# Altium project VOLTAGE_PEAK_V3.PrjPCB
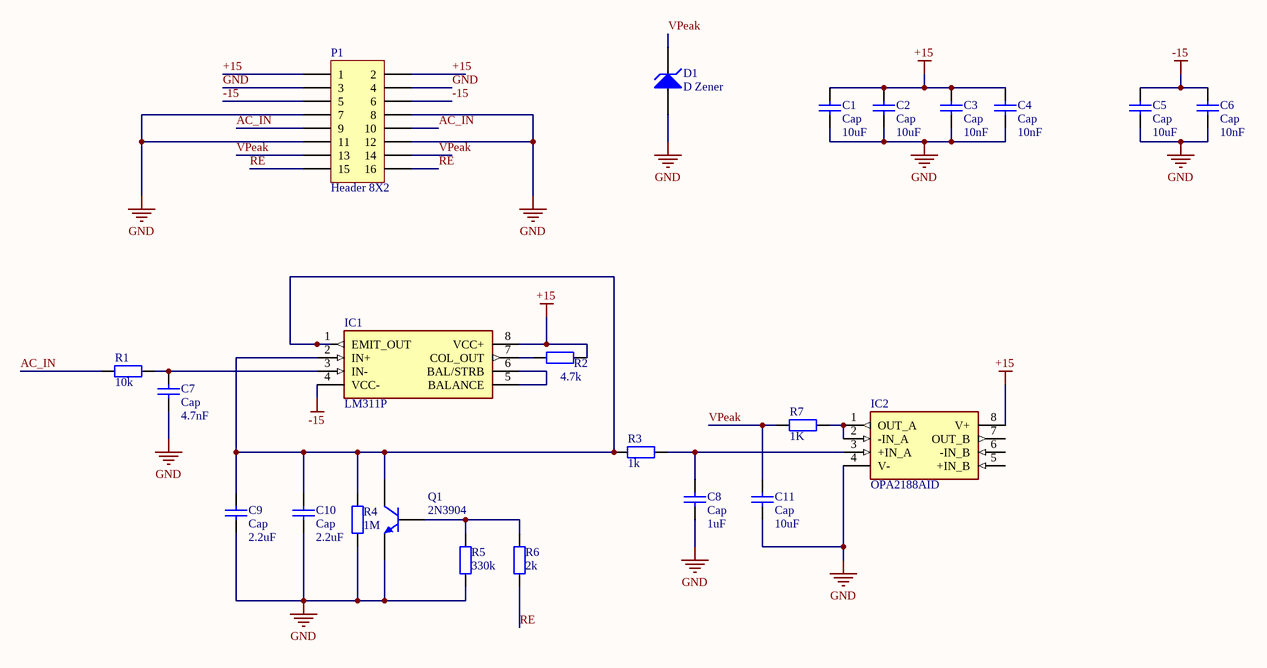
[diagram p0: VOLTAGE_PEAK_V3.SchDoc]
1 sheet, 23 parts. Net scope: global (net labels, ports and power ports of the same name join across sheets).
Board file: VOLTAGE_PEAK_V3.PcbDoc

## Sheet VOLTAGE_PEAK_V3.SchDoc
size A4

### Parts
C1  Cap  value 10uF  [C0805]
C2  Cap  value 10uF  [C0805]
C3  Cap  value 10nF  [1608[0603]]
C4  Cap  value 10nF  [1608[0603]]
C5  Cap  value 10uF  [C0805]
C6  Cap  value 10nF  [1608[0603]]
C7  Cap  value 4.7nF  [1608[0603]]
C8  Cap  value 1uF  [C0805]
C9  Cap  value 2.2uF  [C0805]
C10  Cap  value 2.2uF  [C0805]
C11  Cap  value 10uF  [C0805]
D1  D Zener  [C1206]
IC1  LM311P  [DIP794W53P254L959H508Q8N]
IC2  OPA2188AID  [SOIC127P600X175-8N]
P1  Header 8X2  [HDR2X8]
Q1  2N3904  [TO-92A]
R1  value 10k  [1608[0603]]  (hidden comment: Res2)
R2  value 4.7k  [1608[0603]]  (hidden comment: Res2)
R3  value 1k  [1608[0603]]  (hidden comment: Res2)
R4  value 1M  [1608[0603]]  (hidden comment: Res2)
R5  value 330k  [1608[0603]]  (hidden comment: Res2)
R6  value 2k  [1608[0603]]  (hidden comment: Res2)
R7  value 1K  [1608[0603]]  (hidden comment: Res2)

### Nets
+15: C1.2 C2.2 C3.1 C4.1 IC1.8(VCC+) IC2.8(V+) P1.1 P1.2 R2.2
-15: C5.2 C6.1 IC1.4(VCC-) P1.5 P1.6
GND: C1.1 C2.1 C3.2 C4.2 C5.1 C6.2 C7.2 C8.2 C9.2 C10.2 C11.2 D1.1(A) IC2.4(V-) P1.3 P1.4 P1.7 P1.8 P1.11 P1.12 Q1.1(E) R4.1 R5.1
AC_IN: P1.9 P1.10 R1.1
RE: P1.15 P1.16 R6.1
VPeak: C11.1 D1.2(K) P1.13 P1.14 R7.1
NetC7_1: C7.1 IC1.3(IN-) R1.2
NetC8_1: C8.1 IC2.3(+IN_A) R3.2
NetC9_1: C9.1 C10.1 IC1.1(EMIT_OUT) IC1.2(IN+) Q1.3(C) R3.1 R4.2
NetIC1_5: IC1.5(BALANCE) IC1.6(BAL/STRB)
NetIC1_7: IC1.7(COL_OUT) R2.1
NetIC2_1: IC2.1(OUT_A) IC2.2(-IN_A) R7.2
NetQ1_2: Q1.2(B) R5.2 R6.2

Not connected (* = marked no-connect by the designer): IC2 5(+IN_B) 6(-IN_B) 7(OUT_B)

### Library data of the parts
C1-C11 = Cap: Capacitor; Published: 8-Jun-2000; LatestRevisionDate: 17-Jul-2002; LatestRevisionNote: Re-released for DXP Platform.; PackageReference: RAD-0.3; Publisher: Altium Limited; PackageDescription: Radial Cap, Thru-Hole; 2 Leads; 0.3 in Pin Spacing
D1 = D Zener: Zener Diode; Published: 8-Jun-2000; LatestRevisionDate: 17-Jul-2002; LatestRevisionNote: Re-released for DXP Platform.; PackageReference: DIODE-0.7; Publisher: Altium Limited; PackageDescription: Diode, Thru-Hole; 2 Leads; 0.7 in Pin Spacing
IC1 = LM311P: Integrated Circuit; Manufacturer_Name: Texas Instruments; Datasheet Link: http://www.ti.com/lit/ds/symlink/lm311.pdf; Height: 5.08mm; Manufacturer_Part_Number: LM311P; Mouser Part Number: 595-LM311P; Mouser Price/Stock: https://www.mouser.com/Search/Refine.aspx?Keyword=595-LM311P; RS Part Number: 1218305; RS Price/Stock: https://uk.rs-online.com/web/p/products/1218305
IC2 = OPA2188AID: Integrated Circuit; Manufacturer_Name: Texas Instruments; Datasheet Link: http://www.ti.com/lit/ds/symlink/opa2188.pdf; Height: 1.75mm; Manufacturer_Part_Number: OPA2188AID; Mouser Part Number: 595-OPA2188AID; Mouser Price/Stock: https://www.mouser.com/Search/Refine.aspx?Keyword=595-OPA2188AID; RS Part Number: 9212845; RS Price/Stock: https://uk.rs-online.com/web/p/products/9212845
P1 = Header 8X2: Header, 8-Pin, Dual row; LatestRevisionDate: 17-Jul-2002; LatestRevisionNote: Re-released for DXP Platform.; Publisher: Altium Limited
Q1 = 2N3904: NPN General Purpose Amplifier; Published: 8-Jun-2000; LatestRevisionDate: 15-Jan-2003; LatestRevisionNote: PCB Footprint 'BCY-W3/D4.7' replaced; DatasheetVersion: 1997; PackageVersion: Sep-1998; PackageReference: TO-92A; Publisher: Altium Limited; PackageDescription: TO, Flat Index; 3 In-Line, Axial Leads; Body Dia. 4.5mm; Leads 0.51 x 0.48 mm (max); ComponentLink1Description: Manufacturer Link; ComponentLink1URL: http://www.fairchildsemi.com/; ComponentLink2Description: Datasheet; ComponentLink2URL: http://www.fairchildsemi.com/ds/2N%2F2N3904.pdf
R1-R7 = Res2: Resistor; Published: 8-Jun-2000; LatestRevisionDate: 17-Jul-2002; LatestRevisionNote: Re-released for DXP Platform.; PackageReference: AXIAL-0.4; Publisher: Altium Limited; PackageDescription: Axial Device, Thru-Hole; 2 Leads; 0.4 in Pin Spacing